# Altium project Altium_LED-Resistor.PrjPcb
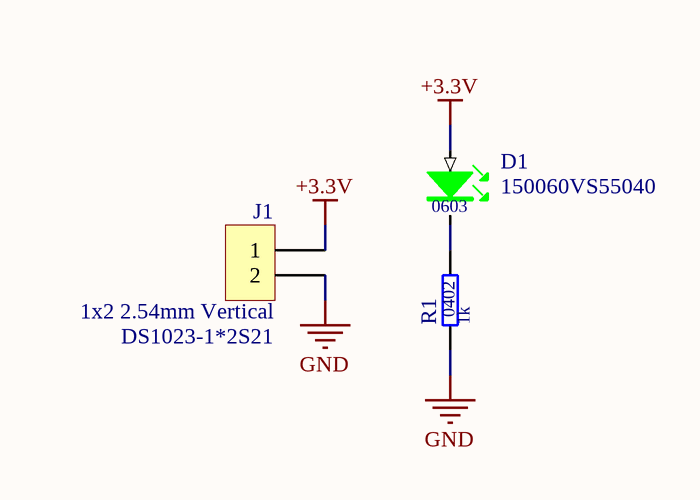
[diagram p0: Altium_LED-Resistor.SchDoc]
1 sheet, 3 parts. Net scope: global (net labels, ports and power ports of the same name join across sheets).

## Sheet Altium_LED-Resistor.SchDoc
size A4; SheetNumber: 1; SheetTotal: 1

### Parts
D1  value 150060VS55040  SCH_Footprint: 0603  [OL_0603_1608]  (hidden comment: Green LED 0603)
J1  value DS1023-1*2S21  SCH_Footprint: 1x2 2.54mm Vertical  [J_HEADER_1x2_2.54_VERTICAL]  (hidden comment: Goldpin female straight)
R1  value 1k  SCH_Footprint: 0402  [R_0402_1005]  (hidden comment: Resistor)

### Nets
+3.3V: D1.2(A) J1.1
GND: J1.2 R1.1
NetD1_1: D1.1(K) R1.2

### Library data of the parts
D1 = OL_G_0603_150060VS55040: LED GREEN; Manufacturer: Wurth; Part Number: OL_G_0603_150060VS55040; HelpURL: https://datasheet.octopart.com/150060VS55040-W%C3%BCrth-Elektronik-datasheet-140170128.pdf; Manufacturer Part Number: 150060VS55040; Supplier 1: TME; Supplier Part Number 1: OSG80603C1E; Supplier 2: RS Components; Supplier Part Number 2: 1766157; Supplier 3: Farnell; Supplier Part Number 3: 2900765; Supplier 4: Mouser; Supplier Part Number 4: 710-150060VS55040; Supplier 5: Digi-Key; Supplier Part Number 5: 732-12017-1-ND; Supplier 6: LCSC
J1 = J_HEADER_1x2_2.54_VERTICAL: Pin Header; Manufacturer: Connfly; Part Number: J_HEADER_1x2_2.54_VERTICAL; HelpURL: https://datasheet.octopart.com/DS1023-1%2A2S21-Connfly-datasheet-81850794.pdf; Manufacturer Part Number: DS1023-1*2S21; Supplier 1: TME; Supplier Part Number 1: ZL262-2SG; Supplier 2: RS Components; Supplier 3: Farnell; Supplier 4: Mouser; Supplier 5: Digi-Key; Supplier 6: LCSC
R1 = R_1k_0402_1: Manufacturer: Yageo; Manufacturer Part Number: RC0402FR-071K; Voltage: 50V; Power: 63mW; Tolerance: 1%; Part Number: R_1k_0402_1; HelpURL: http://www.tme.eu/pl/Document/1a2bc76e2be68b3b1670068306778ce6/rc0402yageo.pdf; Supplier 1: TME; Supplier Part Number 1: RC0402FR-071K; Supplier 2: RS Components; Supplier 3: Farnell; Supplier Part Number 3: 9239235; Supplier 4: Mouser; Supplier Part Number 4: 603-RC0402FR-071KP; Supplier 5: Digi-Key; Supplier Part Number 5: 311-1.00KLRCT-ND; Supplier 6: LCSC